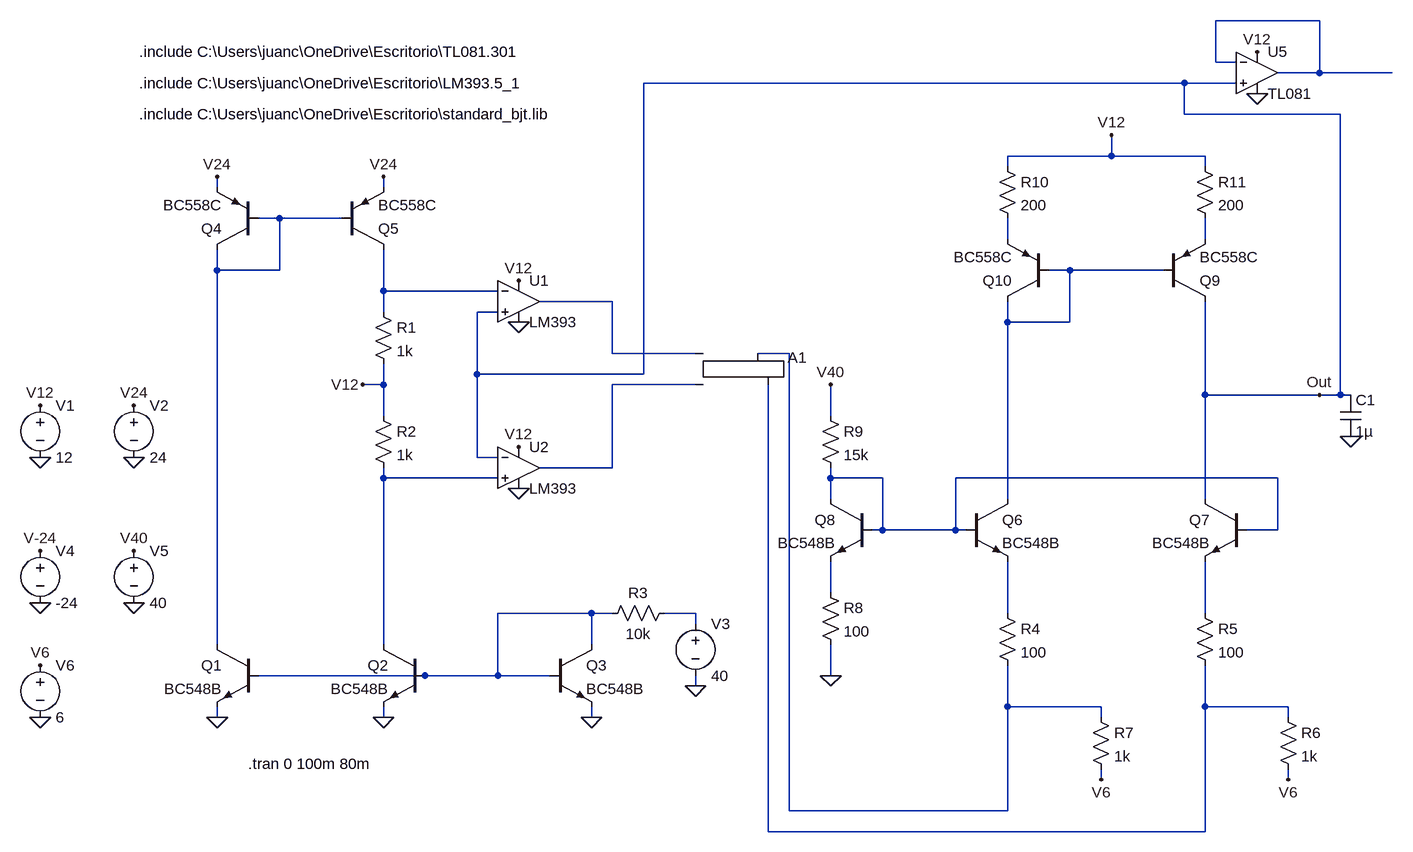
[diagram p0: schematic Gen_triangular_prueba3_PD.asc]
Gen_triangular_prueba3_PD.asc, the LTspice schematic file:
Version 4
SHEET 1 2312 688
WIRE 1824 -688 1664 -688
WIRE 1664 -624 1664 -688
WIRE 1696 -624 1664 -624
WIRE 1824 -608 1824 -688
WIRE 1824 -608 1760 -608
WIRE 1936 -608 1824 -608
WIRE 1616 -592 784 -592
WIRE 1696 -592 1616 -592
WIRE 1616 -544 1616 -592
WIRE 1856 -544 1616 -544
WIRE 1504 -480 1504 -512
WIRE 1504 -480 1344 -480
WIRE 1648 -480 1504 -480
WIRE 1344 -464 1344 -480
WIRE 1648 -464 1648 -480
WIRE 128 -432 128 -448
WIRE 384 -432 384 -448
WIRE 224 -384 192 -384
WIRE 320 -384 224 -384
WIRE 1344 -352 1344 -384
WIRE 1648 -352 1648 -384
WIRE 128 -304 128 -336
WIRE 224 -304 224 -384
WIRE 224 -304 128 -304
WIRE 1440 -304 1408 -304
WIRE 1584 -304 1440 -304
WIRE 384 -272 384 -336
WIRE 560 -272 384 -272
WIRE 736 -256 624 -256
WIRE 384 -240 384 -272
WIRE 560 -240 528 -240
WIRE 1344 -224 1344 -256
WIRE 1440 -224 1440 -304
WIRE 1440 -224 1344 -224
WIRE 736 -176 736 -256
WIRE 864 -176 736 -176
WIRE 1008 -176 960 -176
WIRE 528 -144 528 -240
WIRE 784 -144 784 -592
WIRE 784 -144 528 -144
WIRE 384 -128 384 -160
WIRE 384 -128 352 -128
WIRE 864 -128 736 -128
WIRE 1648 -112 1648 -256
WIRE 1824 -112 1648 -112
WIRE 1856 -112 1856 -544
WIRE 1856 -112 1824 -112
WIRE 1872 -112 1856 -112
WIRE 384 -80 384 -128
WIRE 1072 -80 1072 -128
WIRE 528 -16 528 -144
WIRE 560 -16 528 -16
WIRE 736 0 736 -128
WIRE 736 0 624 0
WIRE 384 16 384 0
WIRE 560 16 384 16
WIRE 1072 16 1072 0
WIRE 1152 16 1072 16
WIRE 1760 16 1264 16
WIRE 1072 48 1072 16
WIRE 1344 48 1344 -224
WIRE 1648 48 1648 -112
WIRE 1152 96 1152 16
WIRE 1152 96 1136 96
WIRE 1264 96 1264 16
WIRE 1264 96 1152 96
WIRE 1280 96 1264 96
WIRE 1760 96 1760 16
WIRE 1760 96 1712 96
WIRE 1072 192 1072 144
WIRE 704 224 560 224
WIRE 736 224 704 224
WIRE 864 224 816 224
WIRE 1344 224 1344 144
WIRE 1648 224 1648 144
WIRE 864 240 864 224
WIRE 128 272 128 -304
WIRE 384 272 384 16
WIRE 704 272 704 224
WIRE 448 320 192 320
WIRE 560 320 560 224
WIRE 560 320 448 320
WIRE 640 320 560 320
WIRE 1072 320 1072 272
WIRE 864 336 864 320
WIRE 1344 368 1344 304
WIRE 1488 368 1344 368
WIRE 1648 368 1648 304
WIRE 1776 368 1648 368
WIRE 128 384 128 368
WIRE 384 384 384 368
WIRE 704 384 704 368
WIRE 1488 384 1488 368
WIRE 1776 384 1776 368
WIRE 1488 480 1488 464
WIRE 1776 480 1776 464
WIRE 1008 528 1008 -176
WIRE 1344 528 1344 368
WIRE 1344 528 1008 528
WIRE 976 560 976 -128
WIRE 1648 560 1648 368
WIRE 1648 560 976 560
FLAG 704 384 0
FLAG 384 384 0
FLAG 128 384 0
FLAG 864 336 0
FLAG -144 -16 0
FLAG 0 -16 0
FLAG 352 -128 V12
FLAG -144 -96 V12
FLAG 0 -96 V24
FLAG 384 -448 V24
FLAG 128 -448 V24
FLAG 592 -224 0
FLAG 592 32 0
FLAG 592 -288 V12
FLAG 592 -32 V12
FLAG 1728 -576 0
FLAG 1728 -640 V12
FLAG -144 208 0
FLAG -144 128 V-24
FLAG 1072 320 0
FLAG 1776 480 V6
FLAG 1488 480 V6
FLAG 1072 -128 V40
FLAG 1872 -48 0
FLAG 1504 -512 V12
FLAG 1824 -112 Out
FLAG 0 208 0
FLAG 0 128 V40
FLAG -144 384 0
FLAG -144 304 V6
SYMBOL npn 192 272 M0
SYMATTR InstName Q1
SYMATTR Value BC548B
SYMBOL npn 448 272 M0
SYMATTR InstName Q2
SYMATTR Value BC548B
SYMBOL npn 640 272 R0
SYMATTR InstName Q3
SYMATTR Value BC548B
SYMBOL pnp 192 -336 R180
SYMATTR InstName Q4
SYMATTR Value BC558C
SYMBOL pnp 320 -336 M180
SYMATTR InstName Q5
SYMATTR Value BC558C
SYMBOL res 368 -256 R0
SYMATTR InstName R1
SYMATTR Value 1k
SYMBOL res 368 -96 R0
SYMATTR InstName R2
SYMATTR Value 1k
SYMBOL res 832 208 R90
WINDOW 0 0 56 VBottom 2
WINDOW 3 32 56 VTop 2
SYMATTR InstName R3
SYMATTR Value 10k
SYMBOL voltage -144 -112 R0
WINDOW 123 0 0 Left 0
WINDOW 39 0 0 Left 0
SYMATTR InstName V1
SYMATTR Value 12
SYMBOL voltage 0 -112 R0
WINDOW 123 0 0 Left 0
WINDOW 39 0 0 Left 0
SYMATTR InstName V2
SYMATTR Value 24
SYMBOL voltage 864 224 R0
WINDOW 123 0 0 Left 0
WINDOW 39 0 0 Left 0
SYMATTR InstName V3
SYMATTR Value 40
SYMBOL Opamps\\opamp2 592 -320 R0
SYMATTR InstName U1
SYMATTR Value LM393
SYMBOL Opamps\\opamp2 592 -64 R0
SYMATTR InstName U2
SYMATTR Value LM393
SYMBOL Digital\\srflop 912 -224 R0
SYMATTR InstName A1
SYMBOL Opamps\\opamp2 1728 -672 R0
SYMATTR InstName U5
SYMATTR Value TL081
SYMBOL voltage -144 112 R0
WINDOW 123 0 0 Left 0
WINDOW 39 0 0 Left 0
SYMATTR InstName V4
SYMATTR Value -24
SYMBOL npn 1280 48 R0
SYMATTR InstName Q6
SYMATTR Value BC548B
SYMBOL npn 1712 48 M0
SYMATTR InstName Q7
SYMATTR Value BC548B
SYMBOL res 1328 208 R0
SYMATTR InstName R4
SYMATTR Value 100
SYMBOL res 1632 208 R0
SYMATTR InstName R5
SYMATTR Value 100
SYMBOL res 1760 368 R0
SYMATTR InstName R6
SYMATTR Value 1k
SYMBOL res 1472 368 R0
SYMATTR InstName R7
SYMATTR Value 1k
SYMBOL npn 1136 48 M0
SYMATTR InstName Q8
SYMATTR Value BC548B
SYMBOL res 1056 176 R0
SYMATTR InstName R8
SYMATTR Value 100
SYMBOL res 1056 -96 R0
SYMATTR InstName R9
SYMATTR Value 15k
SYMBOL cap 1856 -112 R0
SYMATTR InstName C1
SYMATTR Value 1µ
SYMBOL pnp 1584 -256 M180
SYMATTR InstName Q9
SYMATTR Value BC558C
SYMBOL pnp 1408 -256 R180
SYMATTR InstName Q10
SYMATTR Value BC558C
SYMBOL res 1328 -480 R0
SYMATTR InstName R10
SYMATTR Value 200
SYMBOL res 1632 -480 R0
SYMATTR InstName R11
SYMATTR Value 200
SYMBOL voltage 0 112 R0
WINDOW 123 0 0 Left 0
WINDOW 39 0 0 Left 0
SYMATTR InstName V5
SYMATTR Value 40
SYMBOL voltage -144 288 R0
WINDOW 123 0 0 Left 0
WINDOW 39 0 0 Left 0
SYMATTR InstName V6
SYMATTR Value 6
TEXT 8 -544 Left 2 !.include C:\\Users\\juanc\\OneDrive\\Escritorio\\standard_bjt.lib
TEXT 176 456 Left 2 !.tran 0 100m 80m
TEXT 8 -592 Left 2 !.include C:\\Users\\juanc\\OneDrive\\Escritorio\\LM393.5_1
TEXT 8 -640 Left 2 !.include C:\\Users\\juanc\\OneDrive\\Escritorio\\TL081.301

The netlist it stands for:
* Gen_triangular_prueba3_PD.asc
Q1 N002 N013 0 0 BC548B
Q2 N010 N013 0 0 BC548B
Q3 N013 N013 0 0 BC548B
Q4 N002 N002 V24 0 BC558C
Q5 N006 N002 V24 0 BC558C
R1 N006 V12 1k
R2 V12 N010 1k
R3 N014 N013 10k
V1 V12 0 12
V2 V24 0 24
V3 N014 0 40
XU1 Out N006 V12 0 N007 LM393  ; pins In+ In- V+ V- OUT
XU2 N010 Out V12 0 N009 LM393  ; pins In+ In- V+ V- OUT
A1 N007 N009 0 0 0 N017 N008 0 SRFLOP
XU5 Out N001 V12 0 N001 TL081  ; pins In+ In- V+ V- OUT
V4 V-24 0 -24
Q6 N005 N011 N015 0 BC548B
Q7 Out N011 N016 0 BC548B
R4 N015 N008 100
R5 N016 N017 100
R6 N017 V6 1k
R7 N008 V6 1k
Q8 N011 N011 N012 0 BC548B
R8 N012 0 100
R9 V40 N011 15k
C1 Out 0 1µ
Q9 Out N005 N004 0 BC558C
Q10 N005 N005 N003 0 BC558C
R10 V12 N003 200
R11 V12 N004 200
V5 V40 0 40
V6 V6 0 6
.model NPN NPN
.model PNP PNP
.lib standard.bjt
.include C:\Users\juanc\OneDrive\Escritorio\standard_bjt.lib
.tran 0 100m 80m
.include C:\Users\juanc\OneDrive\Escritorio\LM393.5_1
.include C:\Users\juanc\OneDrive\Escritorio\TL081.301
.backanno
.end